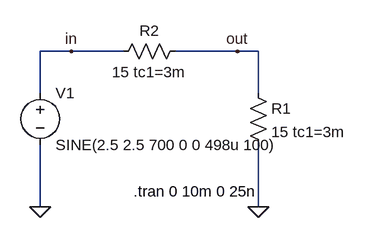
[diagram p0: schematic prvy obvod.asc]
prvy obvod.asc, the LTspice schematic file:
Version 4
SHEET 1 880 680
WIRE 80 64 32 64
WIRE 160 64 80 64
WIRE 336 64 240 64
WIRE 368 64 336 64
WIRE 32 128 32 64
WIRE 368 128 368 64
WIRE 32 304 32 208
WIRE 368 304 368 208
FLAG 368 304 0
FLAG 32 304 0
FLAG 336 64 out
FLAG 80 64 in
SYMBOL res 352 112 R0
SYMATTR InstName R1
SYMATTR Value 15 tc1=3m
SYMBOL res 256 48 R90
WINDOW 0 0 56 VBottom 2
WINDOW 3 32 56 VTop 2
SYMATTR InstName R2
SYMATTR Value 15 tc1=3m
SYMBOL voltage 32 112 R0
WINDOW 123 0 0 Left 2
WINDOW 39 0 0 Left 2
SYMATTR InstName V1
SYMATTR Value SINE(2.5 2.5 700 0 0 498u 100)
TEXT 176 280 Left 2 !.tran 0 10m 0 25n

The netlist it stands for:
* prvy obvod.asc
R1 out 0 15 tc1=3m
R2 out in 15 tc1=3m
V1 in 0 SINE(2.5 2.5 700 0 0 498u 100)
.tran 0 10m 0 25n
.backanno
.end